# EasyEDA Pro project New Project_2024-11-29_16-29-11.eprj

# Schematic Schematic1_1
Board Name: Board1; Create Date: 2024-11-06; Page Name: P1; Project Name: 门锁; Schematic Name: Schematic1; Update Date: 2024-11-29; Company: 嘉立创EDA; Page Size: A4; Version: V1.0
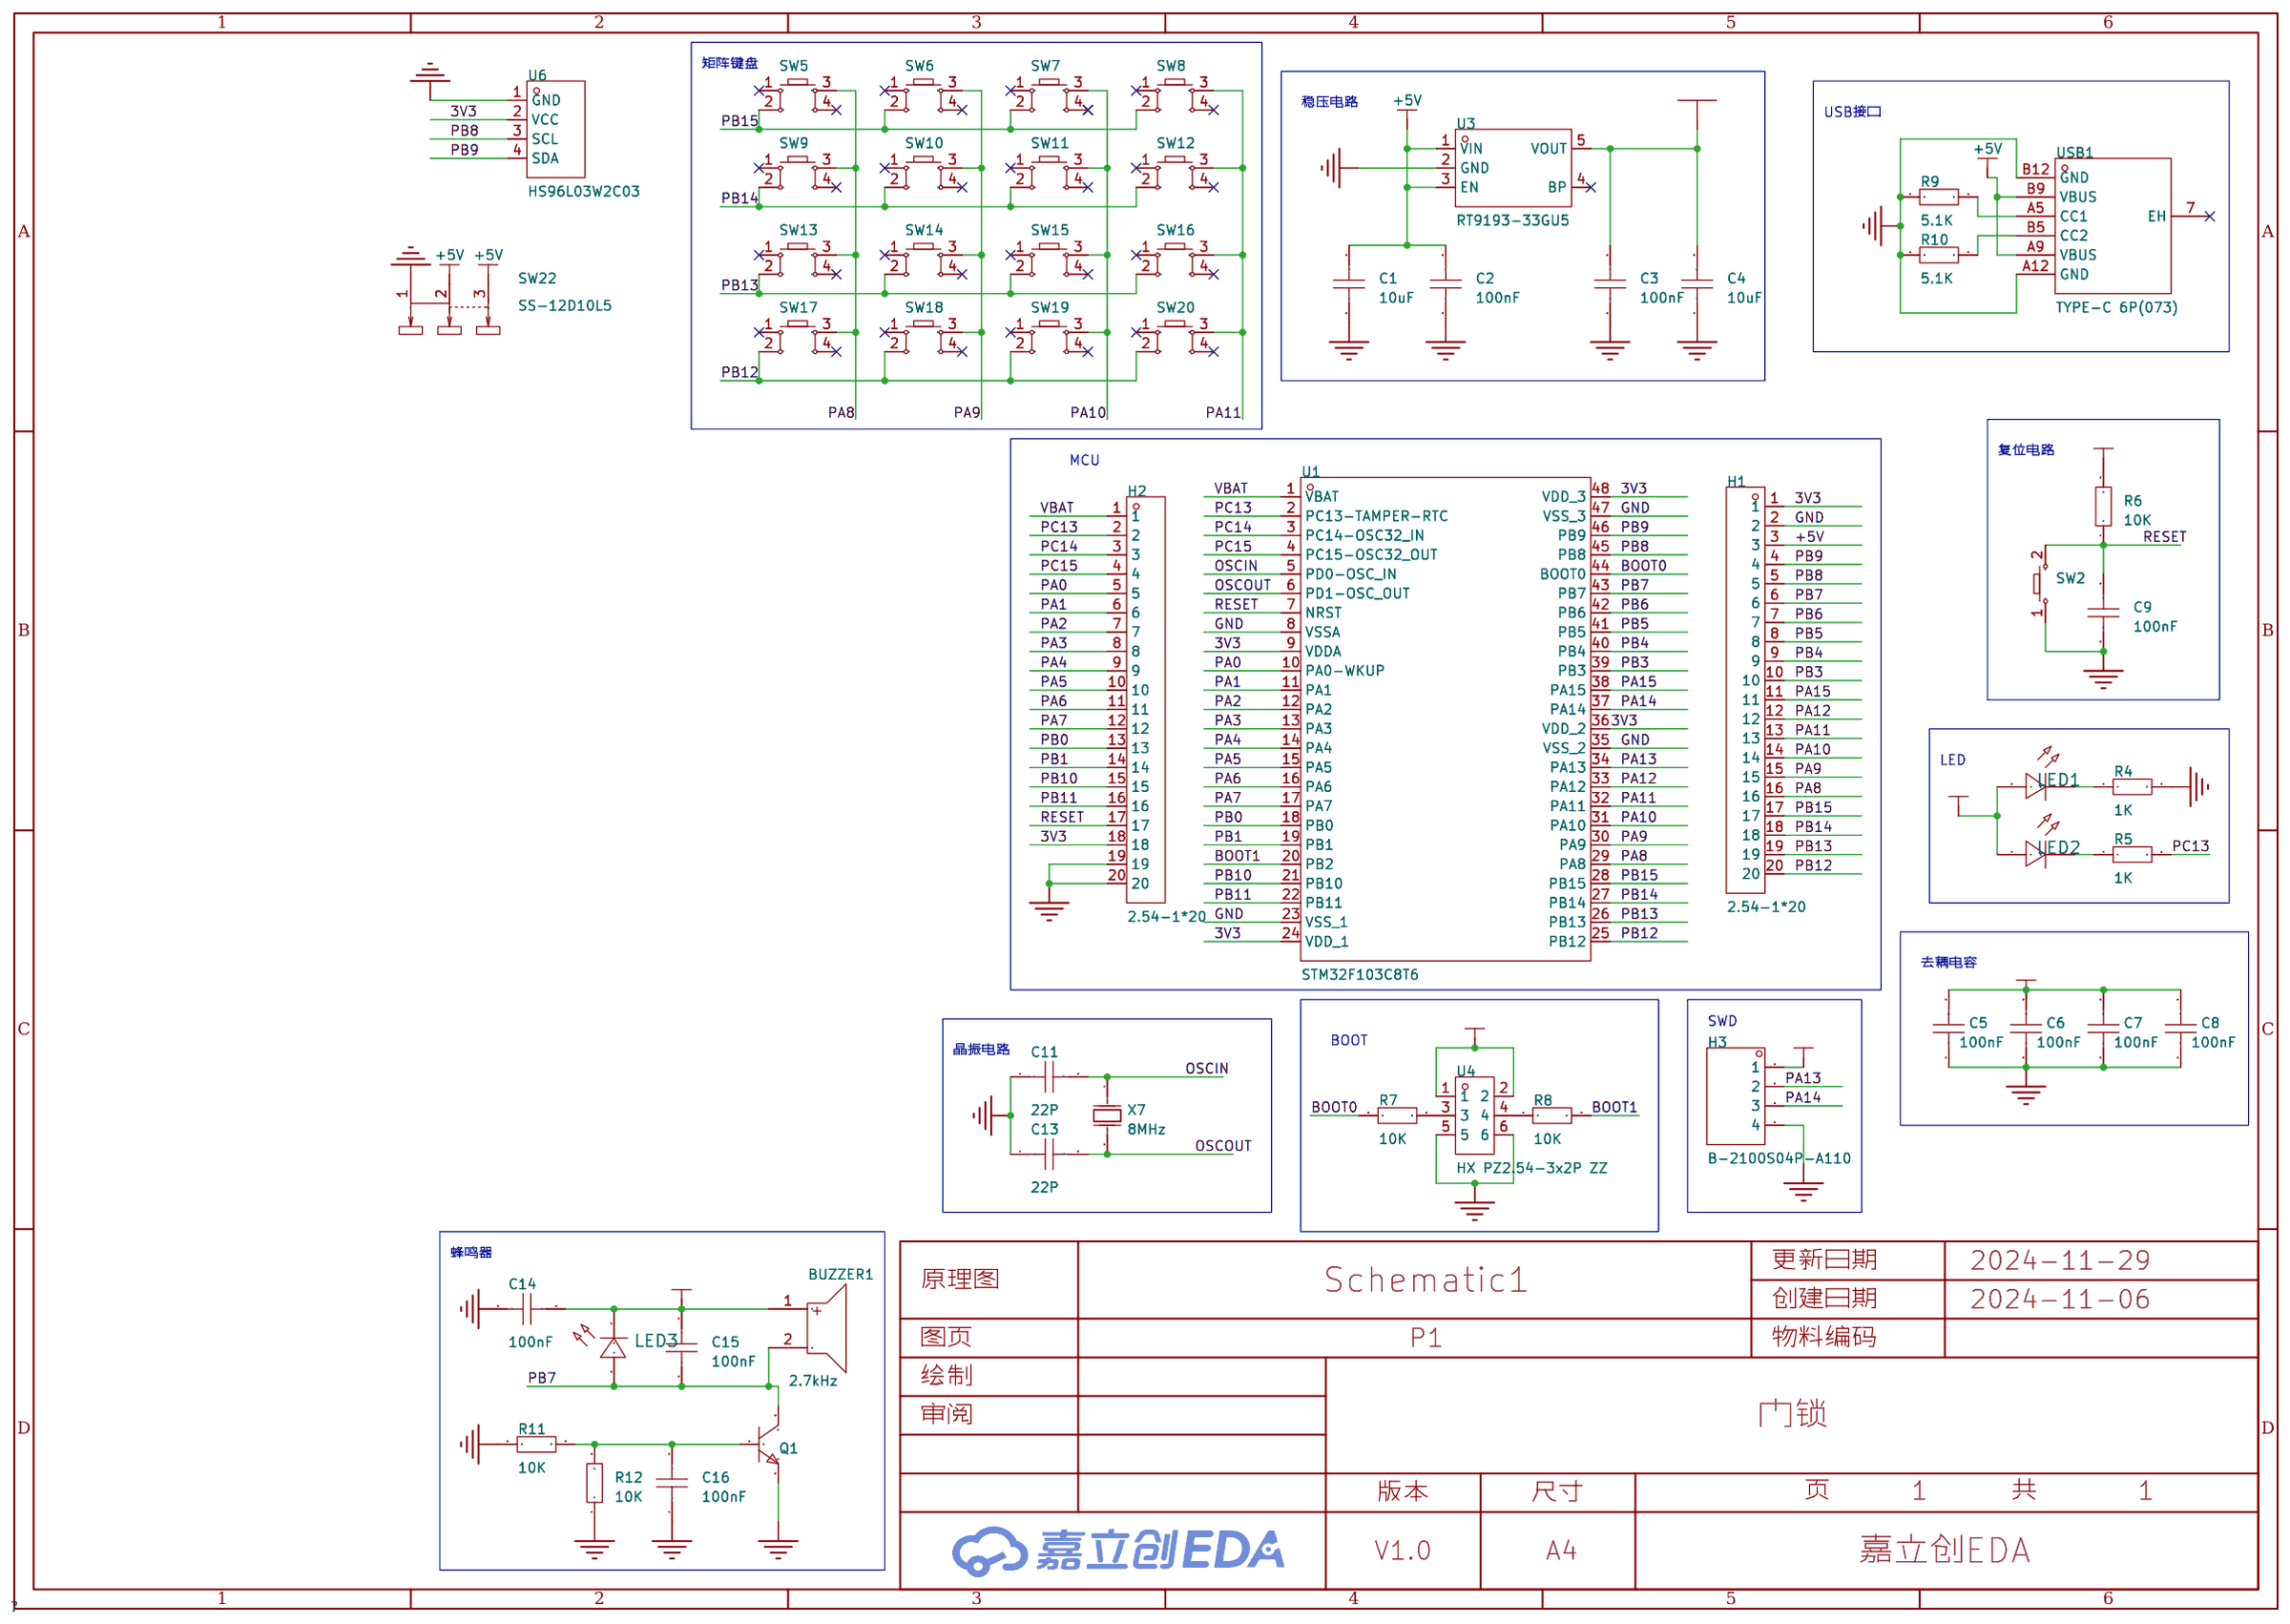
[diagram p0: schematic sheet]

## Parts
BUZZER1  2.7kHz  [BUZ-TH_BD9.0-P4.00-D0.6-FD]
C1  10uF  [C0805]
C2  100nF  [C0805]
C3  100nF  [C0805]
C4  10uF  [C0805]
C5  100nF  [C0603]
C6  100nF  [C0603]
C7  100nF  [C0603]
C8  100nF  [C0603]
C9  100nF  [C0603]
C11  22P  [C0603]
C13  22P  [C0603]
C14  100nF  [C0805]
C15  100nF  [C0805]
C16  100nF  [C0805]
H1  2.54-1*20  [HDR-TH_20P-P2.54-V-M]
H2  2.54-1*20  [HDR-TH_20P-P2.54-V-M]
H3  B-2100S04P-A110  [HDR-TH_4P-P2.54-V-M]
LED1  -  [LED_0603]
LED2  -  [LED_0603]
LED3  -  [LED_0603]
Q1  -  [S8050_SOT-23]
R4  1K  [R0603]
R5  1K  [R0603]
R6  10K  [R0603]
R7  10K  [R0603]
R8  10K  [R0603]
R9  5.1K  [R0805]
R10  5.1K  [R0805]
R11  10K  [R0603]
R12  10K  [R0603]
SW2  -  [Key_SMD_3.6x6.1x2.5]
SW5  -  [SW-SMD_4P-L6.0-W6.0-P4.50-LS9.0-2]
SW6  -  [SW-SMD_4P-L6.0-W6.0-P4.50-LS9.0-2]
SW7  -  [SW-SMD_4P-L6.0-W6.0-P4.50-LS9.0-2]
SW8  -  [SW-SMD_4P-L6.0-W6.0-P4.50-LS9.0-2]
SW9  -  [SW-SMD_4P-L6.0-W6.0-P4.50-LS9.0-2]
SW10  -  [SW-SMD_4P-L6.0-W6.0-P4.50-LS9.0-2]
SW11  -  [SW-SMD_4P-L6.0-W6.0-P4.50-LS9.0-2]
SW12  -  [SW-SMD_4P-L6.0-W6.0-P4.50-LS9.0-2]
SW13  -  [SW-SMD_4P-L6.0-W6.0-P4.50-LS9.0-2]
SW14  -  [SW-SMD_4P-L6.0-W6.0-P4.50-LS9.0-2]
SW15  -  [SW-SMD_4P-L6.0-W6.0-P4.50-LS9.0-2]
SW16  -  [SW-SMD_4P-L6.0-W6.0-P4.50-LS9.0-2]
SW17  -  [SW-SMD_4P-L6.0-W6.0-P4.50-LS9.0-2]
SW18  -  [SW-SMD_4P-L6.0-W6.0-P4.50-LS9.0-2]
SW19  -  [SW-SMD_4P-L6.0-W6.0-P4.50-LS9.0-2]
SW20  -  [SW-SMD_4P-L6.0-W6.0-P4.50-LS9.0-2]
SW22  SS-12D10L5  [SW-TH_SS-12D10L5]
U1  STM32F103C8T6  [LQFP-48_L7.0-W7.0-P0.50-LS9.0-BL]
U3  RT9193-33GU5  [SC-70-5]
U4  HX PZ2.54-3x2P ZZ  [hdr-th_6p-p2.54-v-m-r3-c2-s2.54_2]
U6  HS96L03W2C03  [OLED-TH_L27.8-W27.2-P2.54_C9900033791]
USB1  TYPE-C 6P(073)  [TYPE-C-SMD_TYPE-C-6P_5]
X7  8MHz  [OSC-TH_L10.0-W4.5-P5.00]

## Library data of the parts
BUZZER1 = QMB-09B-03: 驱动方式:无源(外部驱动);构造类型:电磁式;频率:2.7kHz;声压(SPL):85dB@3V,10cm;; LCSC Part Name: 无源蜂鸣器QMB-09B-03; Supplier Part: C96256; Manufacturer: 华能; Supplier Footprint: 插件,D=9mm; JLCPCB Part Class: 扩展库; Datasheet: https://atta.szlcsc.com/upload/public/pdf/source/20210401/C96256_958B17753B5AD7CBFBCFFC7C095B4484.pdf; Supplier: LCSC; Oscillator Circuit: 无源(外部驱动); Technology Type: 电磁式; Operating Voltage: 2V~5V; Sound Pressure Level (SPL): 85dB@3V,10cm; Diameter (φD): 9mm; Height: 5.7mm
C1-C4 C14-C16 = CAP_0805: Supplier Footprint: 0805
C5-C9 C11 C13 = CAP_0603: Supplier Footprint: 0603
H1 H2 = 2.54-1*20: 插针结构:1x20P;间距:2.54mm;排数:单排;总PIN位数:20P;; Supplier Part: C5156618; Manufacturer: ZHOURI(洲日); Supplier Footprint: 插件,P=2.54mm; JLCPCB Part Class: 扩展库; Datasheet: https://atta.szlcsc.com/upload/public/pdf/source/20220915/C001B341F3A1BFCBB64AE1BF6AC1A879.pdf; Supplier: LCSC; Pin Structure: 1x20P; Pitch: 2.54mm; Number of Rows: 单排; Number of Pins: 20P
H3 = B-2100S04P-A110: 插针结构:1x4P;间距:2.54mm;行距:-;圆针/方针:-;安装类型:直插;排数:单排;总PIN位数:4P;额定电流:-;额定电压:-;配合针长度:6mm;塑高:2.54mm;端接针长度:3mm;触头材质:黄铜;触头镀层:-;工作温度范围:-40℃~+105℃;颜色:黑色;; LCSC Part Name: 间距:2.54mm 1x4P 直插; Supplier Part: C124378; Manufacturer: Ckmtw(灿科盟); Supplier Footprint: 插件,P=2.54mm; JLCPCB Part Class: 扩展库; Datasheet: https://atta.szlcsc.com/upload/public/pdf/source/20170821/C124381_1503303309126901535.pdf; Supplier: LCSC; Pin Structure: 1x4P; Pitch: 2.54mm; Mounting Type: 直插; Number of Rows: 单排; Number of Pins: 4P; Length of Mating Pin: 6mm; Insulation Height: 2.54mm; Length of End Connection Pin: 3mm; Contact Material: 黄铜; Operating Temperature Range: -40℃~+105℃; Color: 黑色
LED1-LED3 = LED_0603-R: Supplier Footprint: 0603
Q1 = S8050_SOT_NPN: Supplier Footprint: SOT-23
R4-R8 R11 R12 = Res_0603: Supplier Footprint: 0603
R9 R10 = Res_0805: Supplier Footprint: 0805
SW2 = Key_SMD_3.6x6.1x2.5: Supplier Footprint: SMD
SW5-SW20 = Key_SMD_6x6x6.5: Supplier Footprint: SMD
SW22 = SS-12D10L5: 电路结构:单刀双掷;安装方式:直插;开关颜色:黑色;额定电流(DC):3A;额定电压(DC):125V;额定电流(AC):3A;额定电压(AC):125V;机械寿命:1万次;; LCSC Part Name: 柄长5mm 直插双档 滑动开关; Supplier Part: C319012; Manufacturer: XKB Connectivity(中国星坤); Supplier Footprint: 插件; JLCPCB Part Class: 扩展库; Datasheet: https://atta.szlcsc.com/upload/public/pdf/source/20211009/D6412F37AABE6F9459A6EE7FA4DAEADB.pdf; Supplier: LCSC; Circuit: 单刀双掷; Actuator Style: 矩形柱状; Pin Style: PC引脚; Switch Length: 13mm; Switch Width: 6.8mm; Switch Height: 6.4mm; Mounting Style: 直插; Actuator Color: 黑色; Current Rating (DC): 3A; Voltage Rating (DC): 125V; Current Rating (AC): 3A; Voltage Rating (AC): 125V; Mechanical Life: 1万次; Operating Temperature: -40℃~+85℃
U1 = STM32F103C8T6: CPU内核:ARM-M3;程序存储容量:64KB;RAM总容量:20KB;GPIO端口数量:37;工作电压范围:2V~3.6V;CPU最大主频:72MHz;程序存储器类型:FLASH;; LCSC Part Name: 主流增强型ARM Cortex-M3 MCU，具有64 KB Flash、72 MHz CPU、电机控制、USB和CAN; Supplier Part: C8734; Manufacturer: ST(意法半导体); Supplier Footprint: LQFP-48(7x7); JLCPCB Part Class: 扩展库; Datasheet: https://atta.szlcsc.com/upload/public/pdf/source/20220812/8363ACEC51AD55ECEB84799464F7CB85.pdf; Supplier: LCSC; CPU Core: ARM-M3; Program Storage Size: 64KB; RAM Size: 20KB; GPIO Ports Number: 37; Operating Voltage Range: 2V~3.6V; CPU Maximum Speed: 72MHz; Program Memory Type: FLASH; Operating Temperature Range: -40℃~+85℃; ADC (Bit): 12bit; Universal Serial Bus: 有; Peripheral/Function: 看门狗；DMA；看门狗；温度传感器; Watchdog: 有; Infrared Data Association: 有; Low-Voltage Detect: 有; Direct Memory Access: 有; Internal Oscillator: 有
U3 = RT9193-33GU5: 输出类型:固定;最大输入电压:5.5V;输出电压:3.3V;输出电流:300mA;电源纹波抑制比(PSRR):70dB@(100Hz);输出极性:正极;; LCSC Part Name: 输入5.5V 输出3.3V 300mA; Supplier Part: C425797; Manufacturer: RICHTEK(立锜); JLCPCB Part Class: 扩展库; Datasheet: https://atta.szlcsc.com/upload/public/pdf/source/20191104/C443879_F8E78260AECE296792D45848E485B177.pdf; Supplier: LCSC; Output Type: 固定; Maximum Input Voltage: 5.5V; Output Voltage: 3.3V; Output Current: 300mA; Power Supply Rejection Ratio (PSRR): 70dB@(100Hz); Dropout Voltage: 300mV@(300mA); Output Polarity: 正极; Number of Outputs: 1
U4 = HX PZ2.54-3x2P ZZ: 插针结构:3x2P;间距:2.54mm;行距:2.54mm;圆针/方针:方针;安装类型:直插;排数:三排;总PIN位数:6P;额定电流:3A;额定电压:-;配合针长度:6mm;塑高:2.5mm;端接针长度:3mm;触头材质:黄铜;触头镀层:金;工作温度范围:-40℃~+105℃;颜色:黑色;; LCSC Part Name: 3x2P 间距:2.54mm 方针 直插; Supplier Part: C32713289; Manufacturer: hanxia(韩下); Supplier Footprint: 插件,P=2.54mm; JLCPCB Part Class: 扩展库; Datasheet: https://atta.szlcsc.com/upload/public/pdf/source/20240723/4E1FACE653747A809B5D75F488A270D9.pdf; Supplier: LCSC; Pin Structure: 3x2P; Pitch: 2.54mm; Row Spacing: 2.54mm; Circluar Pins/Square Pins: 方针; Mounting Type: 直插; Number of Rows: 三排; Number of Pins: 6P; Current Rating (Max): 3A; Length of Mating Pin: 6mm; Insulation Height: 2.5mm; Length of End Connection Pin: 3mm; Contact Material: 黄铜; Contact Plating: 金; Operating Temperature Range: -40℃~+105℃; Color: 黑色
U6 = HS96L03W2C03: 主控芯片:SSD1315;接口类型:I2C;尺寸(inch):0.96;像素分辨率:128x64;; LCSC Part Name: 0.96寸OLED显示屏窄白光IIC; Supplier Part: C5248080; Manufacturer: HS(汉昇); JLCPCB Part Class: 扩展库; Datasheet: https://atta.szlcsc.com/upload/public/pdf/source/20230627/763D01F79A90007632F098068C7C8AD9.pdf; Supplier: LCSC; Main Control Chip: SSD1315; Interface Type: I2C; Size: 0.96; Pixel Resolution: 128x64; Operating Temperature: -40℃~+70℃
USB1 = TYPE-C 6P(073): 连接器类型:Type-C;标准:USB 3.1;公母:母;安装方式:卧贴;触点数量:6P;端口数量:1;额定电流 - 电源:3A;工作温度范围:-25℃~+85℃;; LCSC Part Name: Type-C 母 卧贴; Supplier Part: C668623; Manufacturer: SHOU HAN(首韩); Supplier Footprint: SMD; JLCPCB Part Class: 扩展库; Datasheet: https://atta.szlcsc.com/upload/public/pdf/source/20200618/C668623_A4B260DED7AC1949BAC6AE39E9F4CD80.pdf; Supplier: LCSC; Connector Type: Type-C; Standard: USB 3.1; Gender: 母; Mounting Style: 卧贴; Number of Contacts: 6P; Number of Ports: 1; Current Rating - Power (Max): 3A; Operating Temperature Range: -25℃~+85℃; Rated Voltage (Max): 5V; Connect-Disconnect Life: 1万次; Core Colour: 黑色
X7 = X49SD8MSD2SC: 晶振类型:直插晶振;频率:8MHz;常温频差:±20ppm;外接负载电容:20pF;频率稳定度(全温):±30ppm;; LCSC Part Name: 8MHz ±20ppm 20pF; Supplier Part: C21263; Manufacturer: YXC(扬兴晶振); Supplier Footprint: HC-49S; JLCPCB Part Class: 扩展库; Datasheet: https://atta.szlcsc.com/upload/public/pdf/source/20240329/977D7F2434F98B2BE33270BB9FF3D86D.pdf; Supplier: LCSC; Crystal Type: 直插晶振; Normal temperature Frequency Tolerance: ±20ppm; External load capacitor: 20pF; Frequency Stability(Full temperature range): ±30ppm; Operating Temperature: -20℃~+70℃

## Nets
3V3: BUZZER1.1 C3.2 C4.2 C5.2 C6.2 C7.2 C8.2 C14.2 C15.2 H1.1 H2.18 H3.1 LED1.2(A) LED2.2(A) LED3.1(C) R6.2 U1.9(VDDA) U1.24(VDD_1) U1.36(VDD_2) U1.48(VDD_3) U3.5(VOUT) U4.1 U4.2 U6.2(VCC)
+5V: C1.2 C2.2 H1.3 SW22.2 SW22.3 U3.1(VIN) U3.3(EN) USB1.A9(VBUS) USB1.B9(VBUS)
GND: C1.1 C2.1 C3.1 C4.1 C5.1 C6.1 C7.1 C8.1 C9.1 C11.1 C13.1 C14.1 C16.1 H1.2 H2.19 H2.20 H3.4 Q1.2 R4.2 R9.1 R10.2 R11.1 R12.1 SW2.1 SW22.1 U1.8(VSSA) U1.23(VSS_1) U1.35(VSS_2) U1.47(VSS_3) U3.2(GND) U4.5 U4.6 U6.1(GND) USB1.A12(GND) USB1.B12(GND)
VBAT: H2.1 U1.1(VBAT)
BOOT0: R7.1 U1.44(BOOT0)
BOOT1: R8.2 U1.20(PB2)
OSCIN: C11.2 U1.5(PD0-OSC_IN) X7.1(OSC1)
OSCOUT: C13.2 U1.6(PD1-OSC_OUT) X7.2(OSC2)
PA0: H2.5 U1.10(PA0-WKUP)
PA1: H2.6 U1.11(PA1)
PA2: H2.7 U1.12(PA2)
PA3: H2.8 U1.13(PA3)
PA4: H2.9 U1.14(PA4)
PA5: H2.10 U1.15(PA5)
PA6: H2.11 U1.16(PA6)
PA7: H2.12 U1.17(PA7)
PA8: H1.16 SW5.3 SW9.3 SW13.3 SW17.3 U1.29(PA8)
PA9: H1.15 SW6.3 SW10.3 SW14.3 SW18.3 U1.30(PA9)
PA10: H1.14 SW7.3 SW11.3 SW15.3 SW19.3 U1.31(PA10)
PA11: H1.13 SW8.3 SW12.3 SW16.3 SW20.3 U1.32(PA11)
PA12: H1.12 U1.33(PA12)
PA13: H3.2 U1.34(PA13)
PA14: H3.3 U1.37(PA14)
PA15: H1.11 U1.38(PA15)
PB0: H2.13 U1.18(PB0)
PB1: H2.14 U1.19(PB1)
PB3: H1.10 U1.39(PB3)
PB4: H1.9 U1.40(PB4)
PB5: H1.8 U1.41(PB5)
PB6: H1.7 U1.42(PB6)
PB7: BUZZER1.2 C15.1 H1.6 LED3.2(A) Q1.3 U1.43(PB7)
PB8: H1.5 U1.45(PB8) U6.3(SCL)
PB9: H1.4 U1.46(PB9) U6.4(SDA)
PB10: H2.15 U1.21(PB10)
PB11: H2.16 U1.22(PB11)
PB12: H1.20 SW17.2 SW18.2 SW19.2 SW20.2 U1.25(PB12)
PB13: H1.19 SW13.2 SW14.2 SW15.2 SW16.2 U1.26(PB13)
PB14: H1.18 SW9.2 SW10.2 SW11.2 SW12.2 U1.27(PB14)
PB15: H1.17 SW5.2 SW6.2 SW7.2 SW8.2 U1.28(PB15)
PC13: H2.2 R5.2 U1.2(PC13-TAMPER-RTC)
PC14: H2.3 U1.3(PC14-OSC32_IN)
PC15: H2.4 U1.4(PC15-OSC32_OUT)
RESET: C9.2 H2.17 R6.1 SW2.2 U1.7(NRST)
$1N1461: LED1.1(C) R4.1
$1N1462: LED2.1(C) R5.1
$1N1657: R7.2 U4.3
$1N1658: R8.1 U4.4
$1N3993: R9.2 USB1.A5(CC1)
$1N3998: R10.1 USB1.B5(CC2)
$1N7800: C16.2 Q1.1 R11.2 R12.2

Not connected (* = marked no-connect by the designer): SW5 1* 4*; SW6 1* 4*; SW7 1* 4*; SW8 1* 4*; SW9 1* 4*; SW10 1* 4*; SW11 1* 4*; SW12 1* 4*; SW13 1* 4*; SW14 1* 4*; SW15 1* 4*; SW16 1* 4*; SW17 1* 4*; SW18 1* 4*; SW19 1* 4*; SW20 1* 4*; U3 4(BP)*; USB1 7(EH)*

## Notes on the sheet
- 矩阵键盘
- 稳压电路
- USB接口
- 复位电路
- MCU
- LED
- 去耦电容
- SWD
- BOOT
- 晶振电路
- 蜂鸣器

# Board PCB1_1
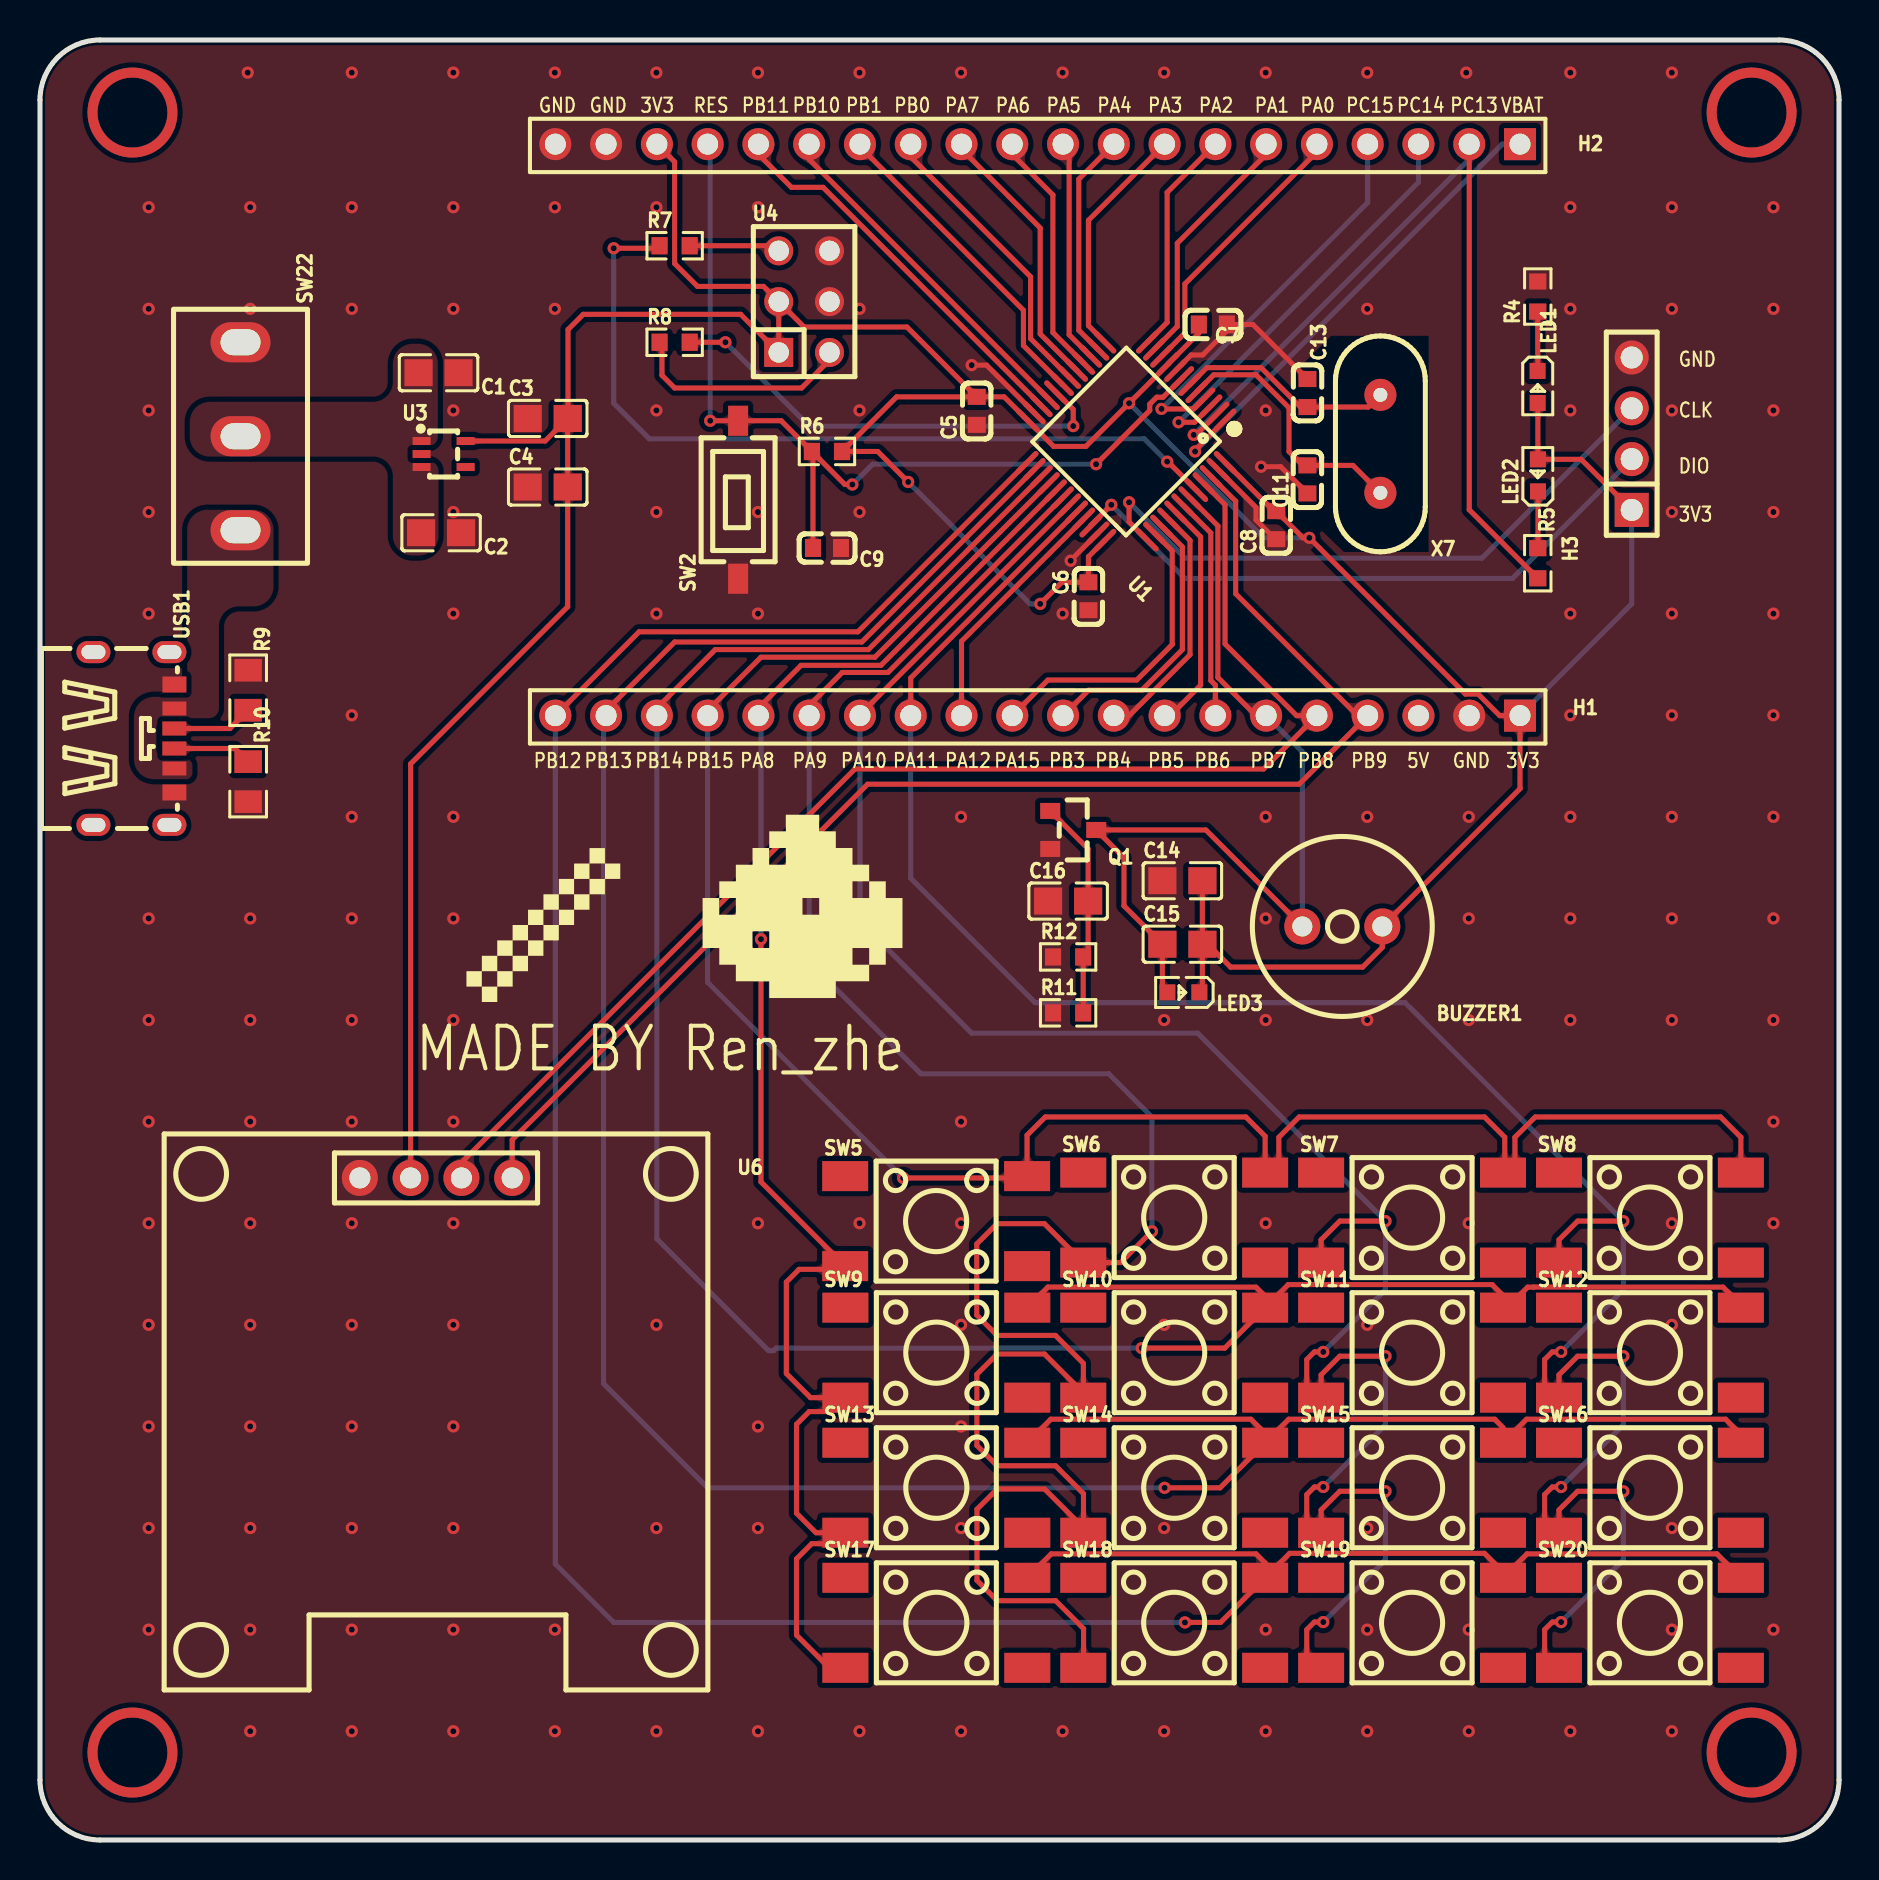
[diagram p1: board, top side]
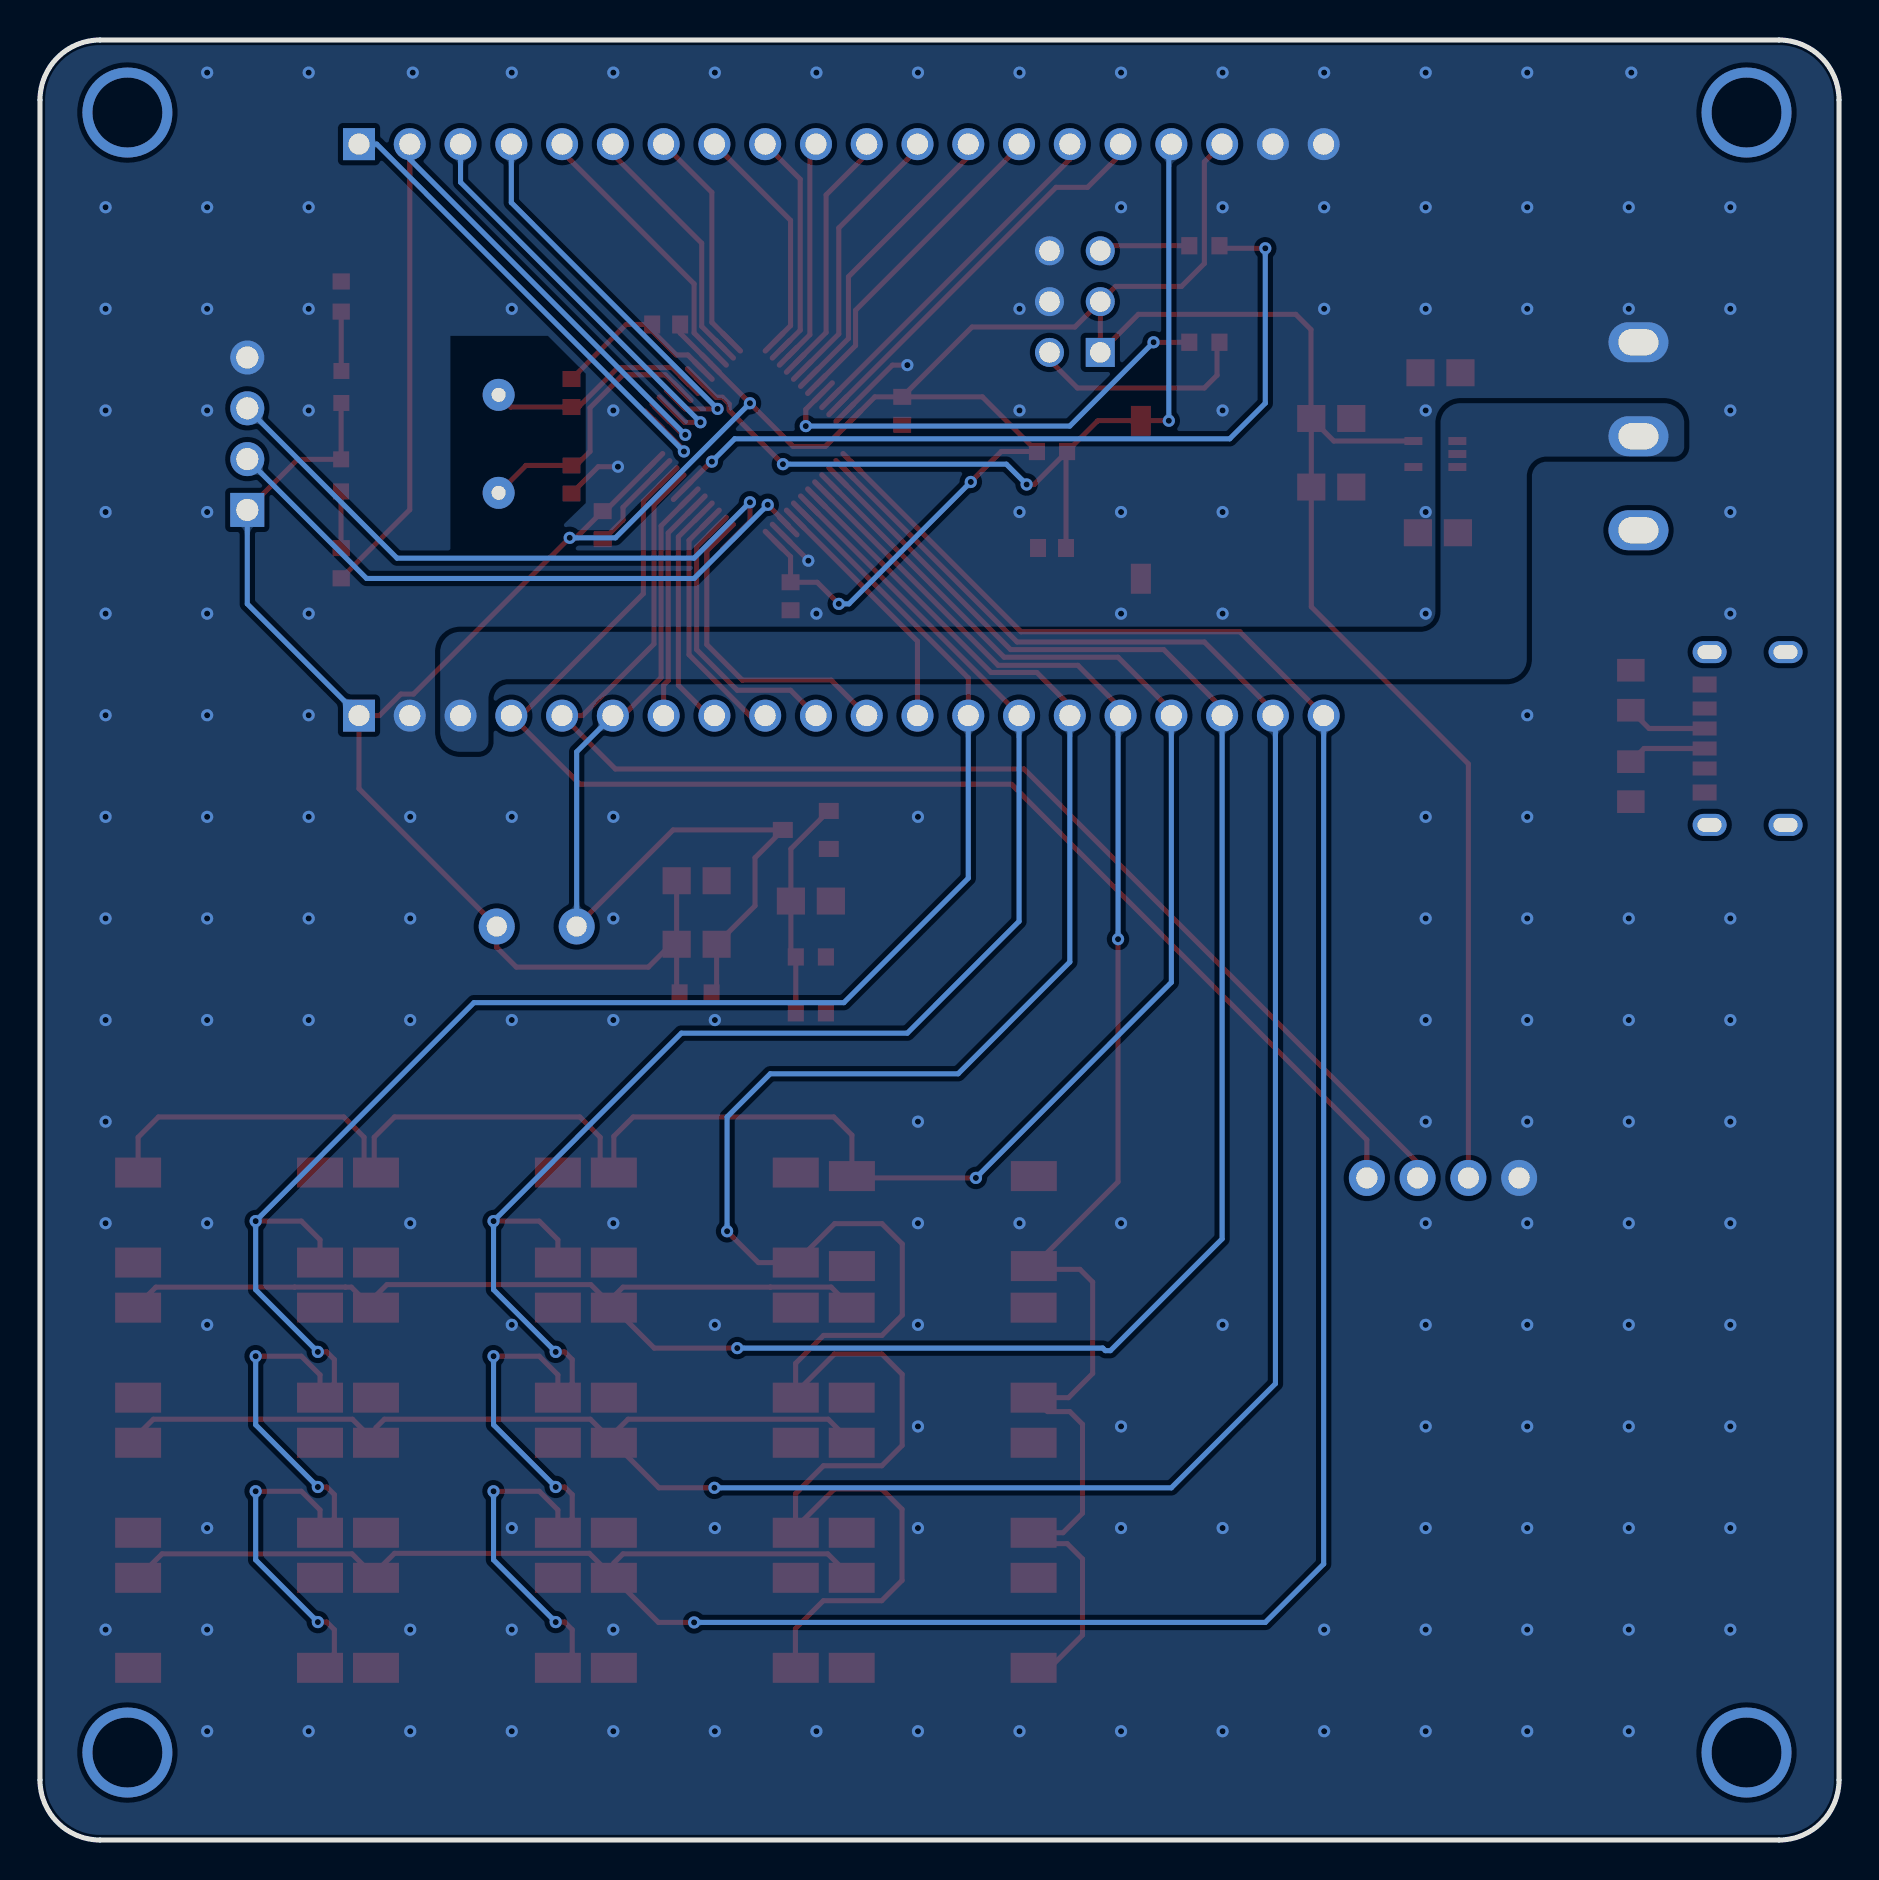
[diagram p2: board, bottom side, seen from below]

Outline 90 x 90 mm; copper layers: Top Layer, Bottom Layer. Coordinates in mm from the lower left corner of the outline.
Outline path: 0,87 0,3 arc(0.88,0.88) 3,0 87,0 arc(89.12,0.88) 90,3 90,87 arc(89.12,89.12) 87,90 3,90 arc(0.88,89.12) 0,87
Stack: Top Layer 0.035mm / Dielectric1 1.51mm FR4 er 4.5 / Bottom Layer 0.035mm

## Design rules (mm)
template: 自定义配置
spacing copperThickness1oz (default): track to track 0.102, other pairs 0.152 to 0.3
spacing copperThickness2oz: track to track 0.203, other pairs 0.152 to 0.3
track width copperThickness1oz (default): min 0.127, default 0.254, max 2.54
track width copperThickness2oz: min 0.203, default 0.254, max 2.54
differential pair differentialPair (default): width min 0.127, default 0.254, max 2.54; gap min 0.152, default 0.152
via viaSize (default): diameter min 0.5, default 0.61, max 10; hole min 0.3, default 0.305, max 6.3

## Placement (name value [footprint] x y rotation side)
BUZZER1  2.7kHz  [BUZ-TH_BD9.0-P4.00-D0.6-FD]  65.15 45.68 180 top
C1  10uF  [C0805]  19.94 73.36 180 top
C2  100nF  [C0805]  20.07 65.36 180 top
C3  100nF  [C0805]  25.4 71.08 0 top
C4  10uF  [C0805]  25.4 67.65 0 top
C5  100nF  [C0603]  46.86 71.46 90 top
C6  100nF  [C0603]  52.45 62.19 90 top
C7  100nF  [C0603]  58.67 75.78 180 top
C8  100nF  [C0603]  61.85 65.74 90 top
C9  100nF  [C0603]  39.37 64.6 180 top
C11  22P  [C0603]  63.41 68.03 90 top
C13  22P  [C0603]  63.41 72.35 270 top
C14  100nF  [C0805]  57.15 47.96 0 top
C15  100nF  [C0805]  57.15 44.79 0 top
C16  100nF  [C0805]  51.43 46.95 0 top
H1  2.54-1*20  [HDR-TH_20P-P2.54-V-M]  49.91 56.22 180 top
H2  2.54-1*20  [HDR-TH_20P-P2.54-V-M]  49.91 84.79 180 top
H3  B-2100S04P-A110  [HDR-TH_4P-P2.54-V-M]  79.63 70.31 90 top
LED1  -  [LED_0603]  74.93 72.6 270 top
LED2  -  [LED_0603]  74.93 68.28 90 top
LED3  -  [LED_0603]  57.15 42.37 180 top
Q1  -  [S8050_SOT-23]  51.69 50.63 180 top
R4  1K  [R0603]  74.93 77.17 90 top
R5  1K  [R0603]  74.93 63.84 270 top
R6  10K  [R0603]  39.37 69.43 0 top
R7  10K  [R0603]  31.75 79.71 0 top
R8  10K  [R0603]  31.75 74.89 0 top
R9  5.1K  [R0805]  10.41 57.49 270 top
R10  5.1K  [R0805]  10.41 52.92 270 top
R11  10K  [R0603]  51.43 41.36 0 top
R12  10K  [R0603]  51.43 44.15 0 top
SW2  -  [Key_SMD_3.6x6.1x2.5]  34.92 67.01 90 top
SW5  -  [SW-SMD_4P-L6.0-W6.0-P4.50-LS9.0-2]  44.83 30.94 0 top
SW6  -  [SW-SMD_4P-L6.0-W6.0-P4.50-LS9.0-2]  56.74 31.12 0 top
SW7  -  [SW-SMD_4P-L6.0-W6.0-P4.50-LS9.0-2]  68.64 31.12 0 top
SW8  -  [SW-SMD_4P-L6.0-W6.0-P4.50-LS9.0-2]  80.54 31.12 0 top
SW9  -  [SW-SMD_4P-L6.0-W6.0-P4.50-LS9.0-2]  44.84 24.37 0 top
SW10  -  [SW-SMD_4P-L6.0-W6.0-P4.50-LS9.0-2]  56.74 24.37 0 top
SW11  -  [SW-SMD_4P-L6.0-W6.0-P4.50-LS9.0-2]  68.64 24.37 0 top
SW12  -  [SW-SMD_4P-L6.0-W6.0-P4.50-LS9.0-2]  80.54 24.37 0 top
SW13  -  [SW-SMD_4P-L6.0-W6.0-P4.50-LS9.0-2]  44.84 17.61 0 top
SW14  -  [SW-SMD_4P-L6.0-W6.0-P4.50-LS9.0-2]  56.74 17.61 0 top
SW15  -  [SW-SMD_4P-L6.0-W6.0-P4.50-LS9.0-2]  68.64 17.61 0 top
SW16  -  [SW-SMD_4P-L6.0-W6.0-P4.50-LS9.0-2]  80.54 17.61 0 top
SW17  -  [SW-SMD_4P-L6.0-W6.0-P4.50-LS9.0-2]  44.84 10.86 0 top
SW18  -  [SW-SMD_4P-L6.0-W6.0-P4.50-LS9.0-2]  56.74 10.86 0 top
SW19  -  [SW-SMD_4P-L6.0-W6.0-P4.50-LS9.0-2]  68.64 10.86 0 top
SW20  -  [SW-SMD_4P-L6.0-W6.0-P4.50-LS9.0-2]  80.54 10.86 0 top
SW22  SS-12D10L5  [SW-TH_SS-12D10L5]  10.03 70.19 270 top
U1  STM32F103C8T6  [LQFP-48_L7.0-W7.0-P0.50-LS9.0-BL]  54.34 69.94 135 top
U3  RT9193-33GU5  [SC-70-5]  20.19 69.3 0 top
U4  HX PZ2.54-3x2P ZZ  [hdr-th_6p-p2.54-v-m-r3-c2-s2.54_2]  38.23 76.92 0 top
U6  HS96L03W2C03  [OLED-TH_L27.8-W27.2-P2.54_C9900033791]  19.81 33.1 0 top
USB1  TYPE-C 6P(073)  [TYPE-C-SMD_TYPE-C-6P_5]  4.7 55.07 270 top
X7  8MHz  [OSC-TH_L10.0-W4.5-P5.00]  67.06 69.81 180 top

## Footprints (pads in the part's own frame, mm; a bottom-side part is the same pattern mirrored in y, then rotated)
BUZ-TH_BD9.0-P4.00-D0.6-FD
  round 1.8 hole 1: 1(-2,0) 2(2,0)
C0603
  rect 0.8x0.9 smd: 1(-0.7,0) 2(0.7,0)
C0805
  rect 1.41x1.35 smd: 1(-1,0) 2(1,0)
HDR-TH_4P-P2.54-V-M
  rect 1.7x1.7 hole 1.1: 1(-3.81,0)
  round 1.7 hole 1.1: 2(-1.27,0) 3(1.27,0) 4(3.81,0)
hdr-th_6p-p2.54-v-m-r3-c2-s2.54_2
  rect 1.45x1.45 hole 1.02: 1(-1.27,-2.54)
  round 1.45 hole 1.02: 2(-1.27,0) 3(-1.27,2.54) 4(1.27,-2.54) 5(1.27,0) 6(1.27,2.54)
HDR-TH_20P-P2.54-V-M
  rect 1.6x1.6 hole 1.05: 1(-24.13,0)
  round 1.6 hole 1.05: 2(-21.59,0) 3(-19.05,0) 4(-16.51,0) 5(-13.97,0) 6(-11.43,0) 7(-8.89,0) 8(-6.35,0) 9(-3.81,0) 10(-1.27,0) 11(1.27,0) 12(3.81,0) 13(6.35,0) 14(8.89,0) 15(11.43,0) 16(13.97,0) 17(16.51,0) 18(19.05,0) 19(21.59,0) 20(24.13,0)
Key_SMD_3.6x6.1x2.5
  rect 1.501x1.001 smd: 1(-3.95,0) 2(3.95,0)
LED_0603
  rect 0.8x0.8 smd: 1(-0.851,-0.01) 2(0.75,-0.005)
LQFP-48_L7.0-W7.0-P0.50-LS9.0-BL
  oval 0.27x1.5 smd: 1(-2.75,-4.25) 2(-2.25,-4.25) 3(-1.75,-4.25) 4(-1.25,-4.25) 5(-0.75,-4.25) 6(-0.25,-4.25) 7(0.25,-4.25) 8(0.75,-4.25) 9(1.25,-4.25) 10(1.75,-4.25) 11(2.25,-4.25) 12(2.75,-4.25) 25(2.75,4.25) 26(2.25,4.25) 27(1.75,4.25) 28(1.25,4.25) 29(0.75,4.25) 30(0.25,4.25) 31(-0.25,4.25) 32(-0.75,4.25) 33(-1.25,4.25) 34(-1.75,4.25) 35(-2.25,4.25) 36(-2.75,4.25)
  oval 1.5x0.27 smd: 13(4.25,-2.75) 14(4.25,-2.25) 15(4.25,-1.75) 16(4.25,-1.25) 17(4.25,-0.75) 18(4.25,-0.25) 19(4.25,0.25) 20(4.25,0.75) 21(4.25,1.25) 22(4.25,1.75) 23(4.25,2.25) 24(4.25,2.75) 37(-4.25,2.75) 38(-4.25,2.25) 39(-4.25,1.75) 40(-4.25,1.25) 41(-4.25,0.75) 42(-4.25,0.25) 43(-4.25,-0.25) 44(-4.25,-0.75) 45(-4.25,-1.25) 46(-4.25,-1.75) 47(-4.25,-2.25) 48(-4.25,-2.75)
OLED-TH_L27.8-W27.2-P2.54_C9900033791
  round 1.8 hole 1.05: 1(-3.81,0) 2(-1.27,0) 3(1.27,0) 4(3.81,0)
OSC-TH_L10.0-W4.5-P5.00
  round 1.6 hole 0.7: 1(0,2.45) 2(0,-2.45)
R0603
  rect 0.806x0.864 smd: 1(-0.753,0) 2(0.753,0)
R0805
  rect 1.133x1.377 smd: 1(-1,0) 2(1,0)
S8050_SOT-23
  rect 1x0.8 smd: 1(1.15,-0.823) 2(1.15,1.077) 3(-1.15,0.127)
SC-70-5
  rect 0.9x0.4 smd: 1(-1.1,0.65) 2(-1.1,0) 3(-1.1,-0.65) 4(1.1,-0.65) 5(1.1,0.65)
SW-SMD_4P-L6.0-W6.0-P4.50-LS9.0-2
  rect 2.3x1.5 smd: 1(-4.55,2.25) 2(4.55,2.25) 3(-4.55,-2.25) 4(4.55,-2.25)
SW-TH_SS-12D10L5
  oval 2x3 hole 1.3x2: 1(-4.7,0) 2(0,0) 3(4.7,0)
TYPE-C-SMD_TYPE-C-6P_5
  oval 1.1x1.7 hole 0.7x1.2: 7(-4.32,1.775) 7(-4.32,-2.025) 7(4.32,1.775) 7(4.32,-2.025)
  rect 0.7x1.2 smd: A5(-0.5,2.025) A9(1.5,2.025) B5(0.5,2.025) B9(-1.5,2.025)
  rect 0.8x1.2 smd: A12(2.7,2.025) B12(-2.7,2.025)

## Nets
As in the schematic.

Pads without a net: SW5 1 4; SW6 1 4; SW7 1 4; SW8 1 4; SW9 1 4; SW10 1 4; SW11 1 4; SW12 1 4; SW13 1 4; SW14 1 4; SW15 1 4; SW16 1 4; SW17 1 4; SW18 1 4; SW19 1 4; SW20 1 4; U3 4; USB1 7

## Via types
v1: diameter 4.5, hole 3.5, Top Layer to Bottom Layer, 4 vias
v2: diameter 0.61, hole 0.305, Top Layer to Bottom Layer, 196 vias

## Routing (per net, layer and track width the routed paths; a pad name or vN(x,y) marks a point on that pad's centre or on a via; arc(x,y) is an arc through that point)
3V3: length 213.8
  Top Layer w0.254: U3.5 25.27,69.95 C3.2 ; C5.2 42.86,72.16 R6.2 41.91,69.43 v2(43.43,67.9) ; C5.2 48.23,72.16 50.71,69.68 52.32,69.68 v2(54.48,71.84) 56.46,73.82 U1.9 57.97,75.34 C7.2 ; C5.2 43.37,75.65 38.23,75.65 U4.2 ; U4.2 36.2,77.68 32.89,77.68 31.75,78.82 31.75,83.9 H2.18 ; U4.2 U4.1 35.05,76.28 27.18,76.28 26.42,75.52 26.42,71.09 C3.2 ; LED3.1 58.15,42.53 C15.2 ; C3.2 C4.2 26.4,61.66 18.54,53.8 U6.2 ; C15.2 58.42,44.79 59.56,43.64 66.17,43.64 67.15,44.63 BUZZER1.1 74.04,52.57 H1.1 73.03,56.22 71.95,57.3 71.31,57.3 v2(63.5,65.11) 63.18,65.11 C8.2 61.73,66.44 U1.48 ; C15.2 C14.2 ; v2(50.04,61.81) 51.12,62.89 C6.2 52.45,64.16 U1.36 ; LED1.2 74.93,71.84 LED2.2 77.1,69.03 H3.1
  Bottom Layer w0.254: v2(54.48,71.84) 61.21,65.11 v2(63.5,65.11) ; H3.1 79.63,61.81 H1.1 ; v2(43.43,67.9) 49.53,61.81 v2(50.04,61.81)
GND: length 22.5
  Top Layer w0.254: C13.1 60.68,75.78 C7.1 59.37,75.46 58.17,74.25 57.59,74.25 U1.8 ; v2(46.61,73.74) 47.35,73.74 49.74,71.36 ; v2(51.56,63.96) 51.56,63.98 U1.35 ; C8.1 61.79,65.04 60.83,66 60.83,66.63 U1.47 ; v2(61.09,68.66) 62.07,68.66 C11.1
  vias: v2(5.44,81.64) v2(5.44,76.56) v2(5.44,71.48) v2(5.44,66.4) v2(5.44,61.32) v2(5.44,46.08) v2(5.44,41) v2(5.44,35.92) v2(5.44,30.84) v2(5.44,25.76) v2(5.44,20.68) v2(5.44,15.6) v2(5.44,10.52) v2(10.39,88.37) v2(10.52,81.64) v2(10.52,76.56) v2(10.52,46.08) v2(10.52,41) v2(10.52,35.92) v2(10.52,30.84) v2(10.52,25.76) v2(10.52,20.68) v2(10.52,15.6) v2(10.52,10.52) v2(10.52,5.44) v2(15.6,88.37) v2(15.6,81.64) v2(15.6,76.56) v2(15.6,56.24) v2(15.6,51.16) v2(15.6,46.08) v2(15.6,41) v2(15.6,35.92) v2(15.6,30.84) v2(15.6,25.76) v2(15.6,20.68) v2(15.6,15.6) v2(15.6,10.52) v2(15.6,5.44) v2(20.68,88.37) v2(20.68,81.64) v2(20.68,76.56) v2(20.68,71.48) v2(20.68,66.4) v2(20.68,61.32) v2(20.68,51.16) v2(20.68,46.08) v2(20.68,41) v2(20.68,35.92) v2(20.68,30.84) v2(20.68,25.76) v2(20.68,20.68) v2(20.68,15.6) v2(20.68,10.52) v2(20.68,5.44) v2(25.76,88.37) v2(25.76,81.64) v2(25.76,76.56) v2(25.76,10.52) v2(25.76,5.44) v2(30.84,88.37) v2(30.84,81.64) v2(30.84,71.48) v2(30.84,66.4) v2(30.84,61.32) v2(30.84,25.76) v2(30.84,15.6) v2(30.84,5.44) v2(35.92,88.37) v2(35.92,81.64) v2(35.92,66.4) v2(35.92,61.32) v2(35.92,30.84) v2(35.92,20.68) v2(35.92,15.6) v2(35.92,5.44) v2(41,88.37) v2(41,76.56) v2(41,71.48) v2(41,66.4) v2(41,30.84) v2(41,5.44) v2(46.08,88.37) v2(46.08,51.16) v2(46.08,35.92) v2(46.08,30.84) v2(46.08,25.76) v2(46.08,20.68) v2(46.08,15.6) v2(46.08,5.44) v2(51.16,88.37) v2(51.16,61.32) v2(51.16,5.44) v2(56.24,88.37) v2(56.24,41) v2(56.24,25.76) v2(56.24,15.6) v2(56.24,5.44) v2(61.32,88.37) v2(61.32,71.48) v2(61.32,51.16) v2(61.32,46.08) v2(61.32,41) v2(61.32,30.84) v2(61.32,10.52) v2(61.32,5.44) v2(66.4,88.37) v2(66.4,76.56) v2(66.4,51.16) v2(66.4,41) v2(66.4,25.76) v2(66.4,15.6) v2(66.4,10.52) v2(66.4,5.44) v2(71.35,88.37) v2(71.48,51.16) v2(71.48,46.08) v2(71.48,41) v2(71.48,30.84) v2(71.48,10.52) v2(71.48,5.44) v2(76.56,88.37) v2(76.56,81.64) v2(76.56,76.56) v2(76.56,71.48) v2(76.56,61.32) v2(76.56,56.24) v2(76.56,51.16) v2(76.56,46.08) v2(76.56,41) v2(76.56,5.44) v2(81.64,88.37) v2(81.64,81.64) v2(81.64,76.56) v2(81.64,71.48) v2(81.64,66.4) v2(81.64,61.32) v2(81.64,56.24) v2(81.64,51.16) v2(81.64,46.08) v2(81.64,41) v2(81.64,30.84) v2(81.64,25.76) v2(81.64,15.6) v2(81.64,10.52) v2(81.64,5.44) v2(86.72,81.64) v2(86.72,76.56) v2(86.72,71.48) v2(86.72,66.4) v2(86.72,61.32) v2(86.72,56.24) v2(86.72,51.16) v2(86.72,46.08) v2(86.72,41) v2(86.72,35.92) v2(86.72,30.84) v2(86.72,10.52)
VBAT: length 24.8
  Top Layer w0.254: 59.29,71 57.78,69.5 v2(57.78,69.43)
  Bottom Layer w0.254: H2.1 73.15,84.79 v2(57.78,69.43)
(no net):
  vias: v1(4.63,86.37) v1(4.63,4.37) v1(85.63,86.37) v1(85.63,4.37)
BOOT0: length 41.1
  Top Layer w0.254: R7.1 30.87,79.59 v2(28.7,79.59) ; 57.87,67.47 56.42,68.92 v2(56.39,68.92)
  Bottom Layer w0.254: v2(56.39,68.92) 55.24,70.06 30.48,70.06 28.7,71.84 v2(28.7,79.59)
BOOT1: length 23
  Top Layer w0.254: R8.2 v2(34.29,74.89) ; v2(51.69,70.7) 51.69,71.53 U1.20
  Bottom Layer w0.254: v2(51.69,70.7) 38.48,70.7 v2(34.29,74.89)
OSCIN: length 13.3
  Top Layer w0.254: 57.87,72.42 58.72,73.26 60.83,73.26 62.48,71.61 62.48,69.43 63.18,68.73 C11.2 65.68,68.73 X7.1
OSCOUT: length 11
  Top Layer w0.254: U1.6 58.37,73.62 61.09,73.62 63.06,71.65 C13.2 66.45,71.65 X7.2
PA0: length 13.8
  Top Layer w0.254: H2.5 63.88,84.41 57.28,77.81 57.28,75.35 56.11,74.18
PA1: length 12.6
  Top Layer w0.254: H2.6 61.34,84.28 56.9,79.84 56.9,75.68 U1.11
PA2: length 11.3
  Top Layer w0.254: U1.12 56.39,75.88 56.39,82.38 H2.7
PA3: length 11.8
  Top Layer w0.254: U1.13 52.45,75.72 52.45,80.98 H2.8
PA4: length 11.4
  Top Layer w0.254: U1.14 52.92,74.54 51.97,75.49 51.97,83.04 H2.9
PA5: length 11.2
  Top Layer w0.254: U1.15 52.56,74.18 51.48,75.26 51.48,84.36 51.18,84.67 H2.10
PA6: length 12.4
  Top Layer w0.254: H2.11 48.64,84.28 50.67,82.25 50.67,75.37 U1.16
PA7: length 13.7
  Top Layer w0.254: H2.12 46.1,84.54 50.04,80.6 50.04,75.3 U1.17
PA8: length 80.6
  Top Layer w0.254: SW17.3 39.48,8.61 37.85,10.24 37.85,14.05 38.61,14.82 39.74,14.82 SW13.3 38.82,15.36 37.85,16.34 37.85,20.78 38.48,21.42 39.59,21.42 SW9.3 38.55,22.12 37.34,23.32 37.34,27.9 37.97,28.53 40.12,28.53 SW5.3 36.07,32.91 v2(36.07,45.04) ; U1.29 42.07,58.73 38.08,58.73 35.94,56.6 H1.16
  Bottom Layer w0.254: H1.16 36.07,56.09 v2(36.07,45.04)
PA9: length 114.4
  Top Layer w0.254: 52.2,22.35 52.2,23.83 50.8,25.23 47.88,25.23 46.86,26.25 46.86,29.8 47.88,30.82 50.24,30.82 SW6.3 54.06,28.87 v2(55.63,30.44) ; 52.2,22.35 50.25,24.3 47.89,24.3 46.87,23.28 46.87,19.73 47.89,18.71 50.81,18.71 52.2,17.31 52.2,15.6 ; 52.2,22.35 52.2,22.12 SW10.3 ; H1.15 38.48,56.73 40.13,58.38 42.42,58.38 U1.30 ; 52.2,8.85 52.21,8.86 52.21,10.57 50.81,11.96 47.89,11.96 46.87,12.98 46.87,16.54 47.89,17.55 50.26,17.55 52.2,15.6 ; 52.2,15.6 52.2,15.6
  Bottom Layer w0.254: v2(55.63,30.44) 55.63,36.15 53.47,38.31 44.07,38.31 38.48,43.9 H1.15
PA10: length 104.9
  Top Layer w0.254: v2(64.2,17.65) 63.75,17.65 63.37,17.27 63.37,16.08 SW15.3 64.09,16.5 65.02,17.44 v2(67.31,17.44) ; 51.51,66.76 41.02,56.27 ; v2(64.2,10.9) 63.75,10.9 63.37,10.52 63.37,9.33 SW19.3 ; v2(67.31,24.19) 65.02,24.19 64.09,23.26 SW11.3 63.37,22.83 63.37,24.02 63.75,24.4 v2(64.2,24.4) ; v2(67.31,30.94) 65.02,30.94 64.09,30.01 SW7.3
  Bottom Layer w0.254: v2(67.31,24.19) 67.31,20.76 v2(64.2,17.65) ; H1.14 41.02,45.93 46.61,40.34 57.91,40.34 v2(67.31,30.94) 67.31,27.52 v2(64.2,24.4) ; v2(67.31,17.44) 67.31,14.01 v2(64.2,10.9)
PA11: length 111.8
  Top Layer w0.254: U1.32 43.56,58.1 H1.13 ; v2(79.21,30.94) 76.92,30.94 75.99,30.01 SW8.3 ; v2(79.21,17.44) 76.92,17.44 75.99,16.5 SW16.3 75.27,16.08 75.27,17.27 75.65,17.65 v2(76.1,17.65) ; v2(76.1,24.4) 75.65,24.4 75.27,24.02 75.27,22.83 SW12.3 75.99,23.26 76.92,24.19 v2(79.21,24.19) ; v2(76.1,10.9) 75.65,10.9 75.27,10.52 75.27,9.33 SW20.3
  Bottom Layer w0.254: v2(79.21,24.19) 79.21,20.76 v2(76.1,17.65) ; H1.13 43.56,48.09 49.78,41.87 68.29,41.87 v2(79.21,30.94) 79.21,27.52 v2(76.1,24.4) ; v2(79.21,17.44) 79.21,14.01 v2(76.1,10.9)
PA12: length 12.4
  Top Layer w0.254: U1.33 46.1,59.94 H1.12
PA13: length 31.5
  Top Layer w0.254: U1.34 52.57,65.74 v2(53.59,66.76)
  Bottom Layer w0.254: v2(53.59,66.76) 57.28,63.08 73.66,63.08 H3.2
PA14: length 31.7
  Top Layer w0.254: v2(54.48,66.89) 54.48,65.91 U1.37
  Bottom Layer w0.254: v2(54.48,66.89) 57.28,64.09 72.14,64.09 H3.3
PA15: length 15.4
  Top Layer w0.254: U1.38 56.64,64.46 56.64,59.77 54.86,58 50.42,58 H1.11
PB0: length 15.1
  Top Layer w0.254: 51.51,73.12 51.5,73.12 49.55,75.07 49.55,78.16 43.43,84.28 43.43,84.67 H2.13
PB1: length 16.2
  Top Layer w0.254: U1.19 51.15,72.77 49.2,74.72 49.2,76.49 41.02,84.67 H2.14
PB3: length 13.9
  Top Layer w0.254: H1.10 52.45,57.49 55.12,57.49 57.15,59.52 57.15,64.65 56.11,65.7
PB4: length 12.3
  Top Layer w0.254: U1.40 57.53,64.98 57.53,59.27 54.48,56.22 H1.9
PB5: length 11.6
  Top Layer w0.254: U1.41 58.06,65.15 58.06,57.74 56.54,56.22 H1.8
PB6: length 11.2
  Top Layer w0.254: U1.42 58.57,65.35 58.57,57.98 58.8,57.75 H1.7
PB7: length 46
  Top Layer w0.254: H1.6 60.83,56.22 58.93,58.12 58.93,65.7 U1.43 ; 56.4,42.38 56.15,42.63 C15.1 54.23,46.71 54.23,49.11 Q1.3 58.33,50.5 BUZZER1.2
  Bottom Layer w0.254: BUZZER1.2 63.15,54.41 H1.6
PB8: length 67.4
  Top Layer w0.254: U1.45 59.28,66.76 59.28,59.8 62.87,56.22 H1.5 61.21,53.55 40.77,53.55 21.08,33.87 U6.3
PB9: length 69
  Top Layer w0.254: U1.46 59.82,66.94 59.82,62.31 65.91,56.22 H1.4 62.99,52.79 41.4,52.79 23.62,35.01 U6.4
PB10: length 17.7
  Top Layer w0.254: H2.15 38.48,84.03 U1.21
PB11: length 19.9
  Top Layer w0.254: H2.16 35.94,84.28 37.59,82.63 39.17,82.63 U1.22
PB12: length 148.2
  Top Layer w0.254: SW17.2 50.59,14.31 60.83,14.31 61.29,13.85 SW18.2 ; SW18.2 59.06,10.88 v2(57.28,10.88) ; SW18.2 62.52,14.33 72.26,14.33 73.19,13.41 SW19.2 74.39,14.31 83.89,14.31 SW20.2 ; U1.25 40.92,60.41 29.97,60.41 H1.20
  Bottom Layer w0.254: v2(57.28,10.88) 28.7,10.88 25.78,13.8 H1.20
PB13: length 135.9
  Top Layer w0.254: SW16.2 85.09,20.28 84.33,21.04 74.37,21.04 SW15.2 73.19,20.62 72.77,21.04 62.47,21.04 SW14.2 ; 49.74,68.53 41.12,59.9 31.75,59.9 28.32,56.47 H1.19 ; SW14.2 59.04,17.61 v2(56.26,17.61) ; SW14.2 61.29,20.33 60.58,21.04 50.57,21.04 SW13.2
  Bottom Layer w0.254: H1.19 28.19,56.09 28.19,22.82 33.4,17.61 v2(56.26,17.61)
PB14: length 123.3
  Top Layer w0.254: v2(55.12,24.59) 59.27,24.59 SW10.2 ; SW10.2 62.44,27.77 72.64,27.77 73.19,27.22 SW11.2 73.4,26.62 74.42,27.64 74.72,27.64 74.73,27.65 77.26,27.65 77.26,27.64 84.2,27.64 85.09,26.75 SW12.2 ; SW10.2 61.29,27.18 60.83,27.64 53.46,27.64 53.46,27.65 50.42,27.65 SW9.2 ; H1.18 30.86,56.6 33.78,59.52 41.44,59.52 U1.27
  Bottom Layer w0.254: H1.18 30.86,30.06 36.45,24.47 36.7,24.47 36.83,24.59 v2(55.12,24.59)
PB15: length 103.7
  Top Layer w0.254: 73.28,33.46 73.79,33.97 73.79,35.14 74.8,36.15 84.07,36.15 85.09,35.14 SW8.2 ; 73.28,33.46 73.28,35.14 72.26,36.15 62.99,36.15 61.98,35.14 61.98,34.06 SW6.2 61.29,35.19 60.33,36.15 50.29,36.15 49.38,35.24 SW5.2 49.29,33.1 v2(43.18,33.1) ; 73.28,33.46 SW7.2 ; H1.17 33.4,56.47 36.07,59.14 41.77,59.14 U1.28
  Bottom Layer w0.254: v2(43.18,33.1) 33.4,42.88 H1.17
PC13: length 45
  Top Layer w0.254: H2.2 71.5,66.51 R5.2 ; v2(57.72,70.26) 57.83,70.26 U1.2
  Bottom Layer w0.254: H2.2 71.5,84.04 v2(57.72,70.26)
PC14: length 20.8
  Top Layer w0.254: U1.3 57.76,70.89 v2(56.96,70.89)
  Bottom Layer w0.254: v2(56.96,70.89) 68.96,82.89 H2.3
PC15: length 19.8
  Top Layer w0.254: U1.4 57.72,71.55 v2(56.1,71.55)
  Bottom Layer w0.254: v2(56.1,71.55) 66.42,81.87 H2.4
RESET: length 46
  Top Layer w0.254: C9.2 38.67,69.37 ; 38.67,69.37 40.27,67.77 v2(40.64,67.77) ; 38.67,69.37 R6.1 37.08,70.96 SW2.2 v2(33.53,70.96) ; U1.7 56.18,72.14 55.86,72.14 55.52,71.8 55.52,71.48 52.83,68.79
  Bottom Layer w0.254: v2(40.64,67.77) 41.66,68.79 v2(52.83,68.79) ; H2.17 33.53,84.67 v2(33.53,70.96)
$1N1461: length 3
  Top Layer w0.254: R4.1 74.93,73.46 LED1.1
$1N1462: length 2.8
  Top Layer w0.254: R5.1 74.94,64.6 LED2.1
$1N1657: length 4.6
  Top Layer w0.254: U4.3 36.7,79.71 R7.2
$1N1658: length 11.3
  Top Layer w0.254: U4.4 39.5,74 38.1,72.6 31.75,72.6 31.11,73.24 31.11,74.77 R8.1
$1N3993: length 4.1
  Top Layer w0.254: 6.72,55.57 9.5,55.57 R9.2
$1N3998: length 4
  Top Layer w0.254: 6.72,54.57 9.75,54.57 R10.1
$1N7800: length 11
  Top Layer w0.254: R11.2 R12.2 52.43,44.4 C16.2 52.43,49.56 Q1.1

## Copper pours and planes (outline as drawn; the poured copper is in the pictures)
+5V on Top Layer: 8.49,69.17 7.79,69.46 7.49,70.17 7.49,70.91 7.79,71.62 8.49,71.91 16.65,71.91 17.36,72.2 17.65,72.91 17.65,73.82 17.95,74.52 18.65,74.82 18.9,74.82 19.61,74.52 19.9,73.82 19.9,70.18 19.76,69.83 19.4,69.68 18.77,69.68 18.55,69.59 18.47,69.38 18.47,69.25 18.55,69.04 18.77,68.95 19.44,68.95 19.79,68.8 19.94,68.45 19.94,65.22 19.65,64.52 18.94,64.22 18.65,64.22 17.95,64.52 17.65,65.22 17.65,68.17 17.36,68.88 16.65,69.17
+5V on Bottom Layer: 8.25,69.17 7.89,69.32 7.75,69.67 7.75,70.84 8.04,71.55 8.75,71.84 18.94,71.84 19.65,71.55 19.94,70.84 19.94,61.41 20.23,60.7 20.94,60.41 68.98,60.41 69.68,60.12 69.98,59.41 69.98,55.41 69.68,54.7 68.98,54.41 68.06,54.41 67.71,54.56 67.56,54.91 67.56,57.04 67.27,57.75 66.56,58.04 16.62,58.04 15.91,58.33 15.62,59.04 15.62,68.17 15.33,68.88 14.62,69.17
GND on Top Layer: -3.81,94.7 96.65,94.7 96.65,-6.01 -3.81,-6.01
GND on Bottom Layer: -11.94,99.78 100.46,99.78 100.46,-9.7 -11.94,-9.7
+5V on Top Layer: 7.33,54.03 7.54,53.95 7.63,53.73 7.63,53.34 7.54,53.13 7.33,53.04 5.7,53.04 4.99,53.34 4.7,54.04 4.7,56.16 4.99,56.87 5.7,57.16 6.37,57.16 7.07,57.45 7.37,58.16 7.37,65.51 7.66,66.22 8.37,66.51 10.68,66.51 11.39,66.22 11.68,65.51 11.68,62.68 11.39,61.97 10.68,61.68 9.95,61.68 9.25,61.39 8.95,60.68 8.95,56.59 8.81,56.24 8.45,56.09 7.37,56.09 6.32,56.09 5.97,55.95 5.82,55.59 5.82,54.53 5.97,54.18 6.32,54.03

Small or netless copper shapes (teardrops, artwork), in the pictures only: 211 on Top Layer, 53 on Bottom Layer

## Text on the board
Top Silkscreen Layer: PB12 | GND | PB13 | PB14 | 3V3 | PB15 | RES | PA8 | PB11 | PB10 | PA9 | PA10 | PB1 | PA11 | PB0 | PA7 | PA12 | PA15 | PA6 | PA5 | PB3 | PB4 | PA4 | PA3 | PB5 | PB6 | PA2 | PB7 | PA1 | PB8 | PA0 | PC15 | PB9 | PC14 | 5V | PC13 | VBAT | CLK | DIO | MADE BY Ren_zhe
